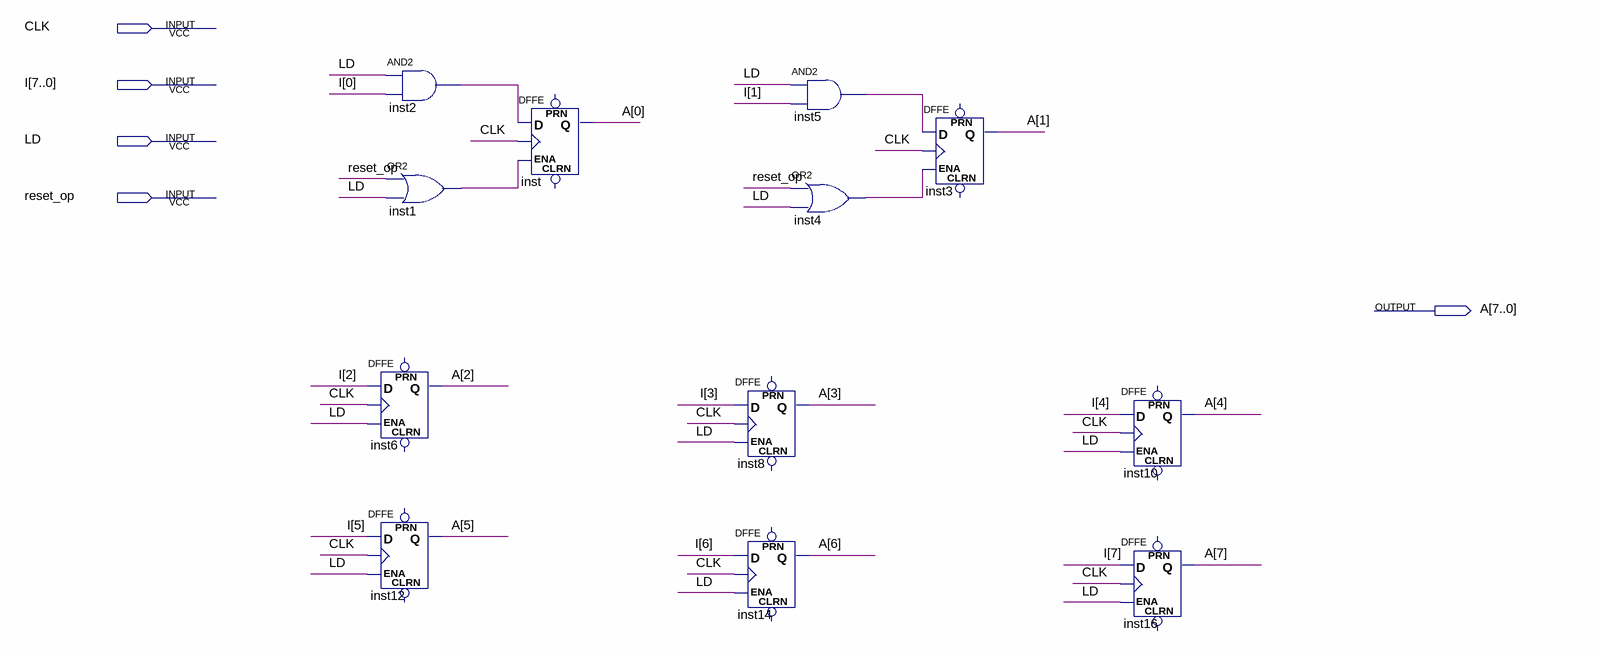
[diagram p0: schematic sheet]
// Quartus schematic GPU_control_register.bdf as structural Verilog: 12 symbols, 5 pins
module GPU_control_register (
  input  CLK,
  input  [7:0] I,
  input  LD,
  input  reset_op,
  output [7:0] A
);

  wire inst1_out, inst2_out, inst4_out, inst5_out;

  DFFE inst6 (.D(I[2]), .CLK(CLK), .ENA(LD), .Q(A[2]));  // open: PRN, CLRN
  DFFE inst12 (.D(I[5]), .CLK(CLK), .ENA(LD), .Q(A[5]));  // open: PRN, CLRN
  and inst2 (inst2_out, LD, I[0]);
  or inst1 (inst1_out, reset_op, LD);
  DFFE inst (.D(inst2_out), .CLK(CLK), .ENA(inst1_out), .Q(A[0]));  // open: PRN, CLRN
  DFFE inst8 (.D(I[3]), .CLK(CLK), .ENA(LD), .Q(A[3]));  // open: PRN, CLRN
  DFFE inst14 (.D(I[6]), .CLK(CLK), .ENA(LD), .Q(A[6]));  // open: PRN, CLRN
  and inst5 (inst5_out, LD, I[1]);
  or inst4 (inst4_out, reset_op, LD);
  DFFE inst3 (.D(inst5_out), .CLK(CLK), .ENA(inst4_out), .Q(A[1]));  // open: PRN, CLRN
  DFFE inst10 (.D(I[4]), .CLK(CLK), .ENA(LD), .Q(A[4]));  // open: PRN, CLRN
  DFFE inst16 (.D(I[7]), .CLK(CLK), .ENA(LD), .Q(A[7]));  // open: PRN, CLRN
endmodule
